# EAGLE design pomodoro-timer-shield (EAGLE 6.3)
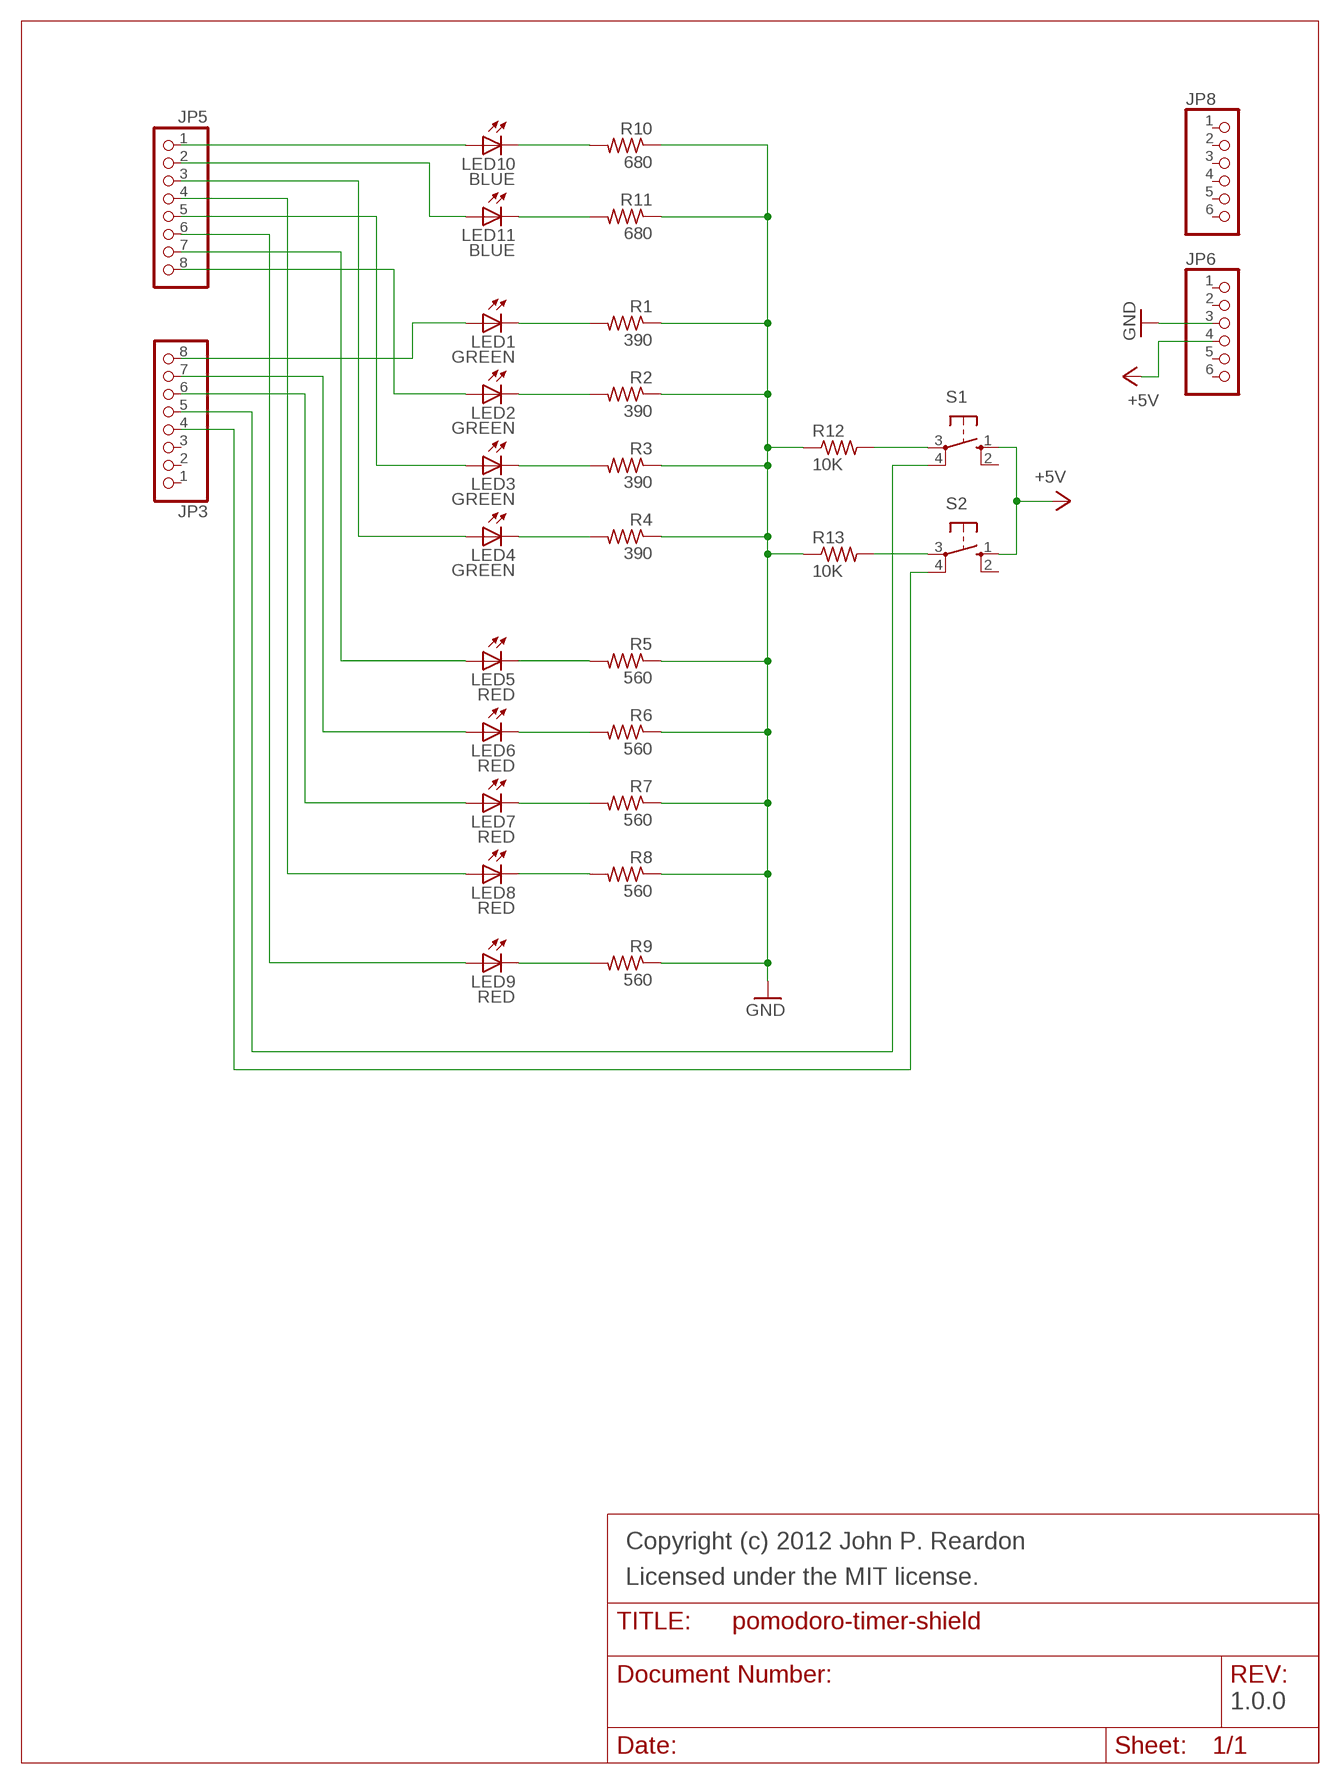
[diagram p0: schematic, sheet 1]

## Parts
JP3  PINHD-1X8CLEANBIG  [1X08-CLEANBIG]
JP5  PINHD-1X8CLEANBIG  [1X08-CLEANBIG]
JP6  PINHD-1X6CB  [1X06-CLEANBIG]
JP8  PINHD-1X6CB  [1X06-CLEANBIG]
LED1  GREEN  LED3MM  [LED3MM]
LED2  GREEN  LED3MM  [LED3MM]
LED3  GREEN  LED3MM  [LED3MM]
LED4  GREEN  LED3MM  [LED3MM]
LED5  RED  LED3MM  [LED3MM]
LED6  RED  LED3MM  [LED3MM]
LED7  RED  LED3MM  [LED3MM]
LED8  RED  LED3MM  [LED3MM]
LED9  RED  LED3MM  [LED3MM]
LED10  BLUE  LED3MM  [LED3MM]
LED11  BLUE  LED3MM  [LED3MM]
R1  390  R-US_0204/7  [0204/7]
R2  390  R-US_0204/7  [0204/7]
R3  390  R-US_0204/7  [0204/7]
R4  390  R-US_0204/7  [0204/7]
R5  560  R-US_0204/7  [0204/7]
R6  560  R-US_0204/7  [0204/7]
R7  560  R-US_0204/7  [0204/7]
R8  560  R-US_0204/7  [0204/7]
R9  560  R-US_0204/7  [0204/7]
R10  680  R-US_0204/7  [0204/7]
R11  680  R-US_0204/7  [0204/7]
R12  10K  R-US_0204/7  [0204/7]
R13  10K  R-US_0204/7  [0204/7]
S1  10-XX  [B3F-10XX]
S2  10-XX  [B3F-10XX]

## Nets
+5V: JP6.4 S1.1(S) S2.1(S)
GND: JP6.3 R1.1 R2.1 R3.1 R4.1 R5.1 R6.1 R7.1 R8.1 R9.1 R10.1 R11.1 R12.1 R13.1
N$1: JP5.1 LED10.A
N$2: LED10.K(C) R10.2
N$3: LED11.K(C) R11.2
N$4: LED5.K(C) R5.2
N$5: LED4.K(C) R4.2
N$6: LED8.K(C) R8.2
N$8: LED3.K(C) R3.2
N$15: LED2.K(C) R2.2
N$16: LED1.K(C) R1.2
N$25: LED7.K(C) R7.2
N$26: LED6.K(C) R6.2
N$27: LED9.K(C) R9.2
N$28: R12.2 S1.3(P)
N$29: R13.2 S2.3(P)
N$35: JP3.5 S1.4(P1)
N$40: JP3.4 S2.4(P1)
N$45: JP5.2 LED11.A
N$54: JP3.8 LED1.A
N$55: JP5.8 LED2.A
N$56: JP5.7 LED5.A
N$57: JP5.5 LED3.A
N$58: JP5.3 LED4.A
N$59: JP3.7 LED6.A
N$62: JP3.6 LED7.A
N$63: JP5.4 LED8.A
N$67: JP5.6 LED9.A
Unconnected: JP3.1 JP3.2 JP3.3 JP6.1 JP6.2 JP6.5 JP6.6 JP8.1 JP8.2 JP8.3 JP8.4 JP8.5 JP8.6 S1.2(S1) S2.2(S1)

## Notes on the sheet
- Copyright (c) 2012 John P. Reardon
- Licensed under the MIT license.
- 1.0.0

## Library data of the parts
JP3 JP5 = carduino:PINHD-1X8: PIN HEADER
JP6 JP8 = carduino:PINHD-1X6: PIN HEADER
LED1-LED11 = led:LED: LED OSRAM: - CHIPLED LG R971, LG N971, LY N971, LG Q971, LY Q971, LO R971, LY R971 LH N974, LH R974 LS Q976, LO Q976, LY Q976 LO Q996 - Hyper CHIPLED LW Q18S LB Q993, LB Q99A, LB R99A - SideLED LS A670, LO A670, LY A670, LG A670, LP A670 LB A673, LV A673, LT A673, LW A673 LH A674 LY A675 LS A676, LA A676, LO A676, LY A676, LW A676 LS A679, LY A679, LG A679 - Hyper Micro SIDELED® LS Y876, LA Y876, LO Y876, LY Y876 LT Y87S - SmartLED LW L88C, LW L88S LB L89C, LB L89S, LG L890 LS L89K, LO L89K, LY L89K LS L896, LA L896, LO L896, LY L896 - TOPLED LS T670, LO T670, LY T670, LG T670, LP T670 LSG T670, LSP T670, LSY T670, LOP T670, LYG T670 LG T671, LOG T671, LSG T671 LB T673, LV T673, LT T673, LW T673 LH T674 LS T676, LA T676, LO T676, LY T676, LB T676, LH T676, LSB T676, LW T676 LB T67C, LV T67C, LT T67C, LS T67K, LO T67K, LY T67K, LW E67C LS E67B, LA E67B, LO E67B, LY E67B, LB E67C, LV E67C, LT E67C LW T67C LS T679, LY T679, LG T679 LS T770, LO T770, LY T770, LG T770, LP T770 LB T773, LV T773, LT T773, LW T773 LH T774 LS E675, LA E675, LY E675, LS T675 LS T776, LA T776, LO T776, LY T776, LB T776 LHGB T686 LT T68C, LB T68C - Hyper Mini TOPLED® LB M676 - Mini TOPLED Santana® LG M470 LS M47K, LO M47K, LY M47K Source: http://www.osram.convergy.de LUXEON: - LUMILED® LXK2-PW12-R00, LXK2-PW12-S00, LXK2-PW14-U00, LXK2-PW14-V00 LXK2-PM12-R00, LXK2-PM12-S00, LXK2-PM14-U00 LXK2-PE12-Q00, LXK2-PE12-R00, LXK2-PE12-S00, LXK2-PE14-T00, LXK2-PE14-U00 LXK2-PB12-K00, LXK2-PB12-L00, LXK2-PB12-M00, LXK2-PB14-N00, LXK2-PB14-P00, LXK2-PB14-Q00 LXK2-PR12-L00, LXK2-PR12-M00, LXK2-PR14-Q00, LXK2-PR14-R00 LXK2-PD12-Q00, LXK2-PD12-R00, LXK2-PD12-S00 LXK2-PH12-R00, LXK2-PH12-S00 LXK2-PL12-P00, LXK2-PL12-Q00, LXK2-PL12-R00 Source: www.luxeon.com KINGBRIGHT: KA-3528ASYC Source: www.kingbright.com
R1-R13 = resistor:R-US_: RESISTOR, American symbol
S1 S2 = switch-omron:10-XX: OMRON SWITCH; MPN: B3F-1000; OC_FARNELL: 176432; OC_NEWARK: 36M3542

## Board
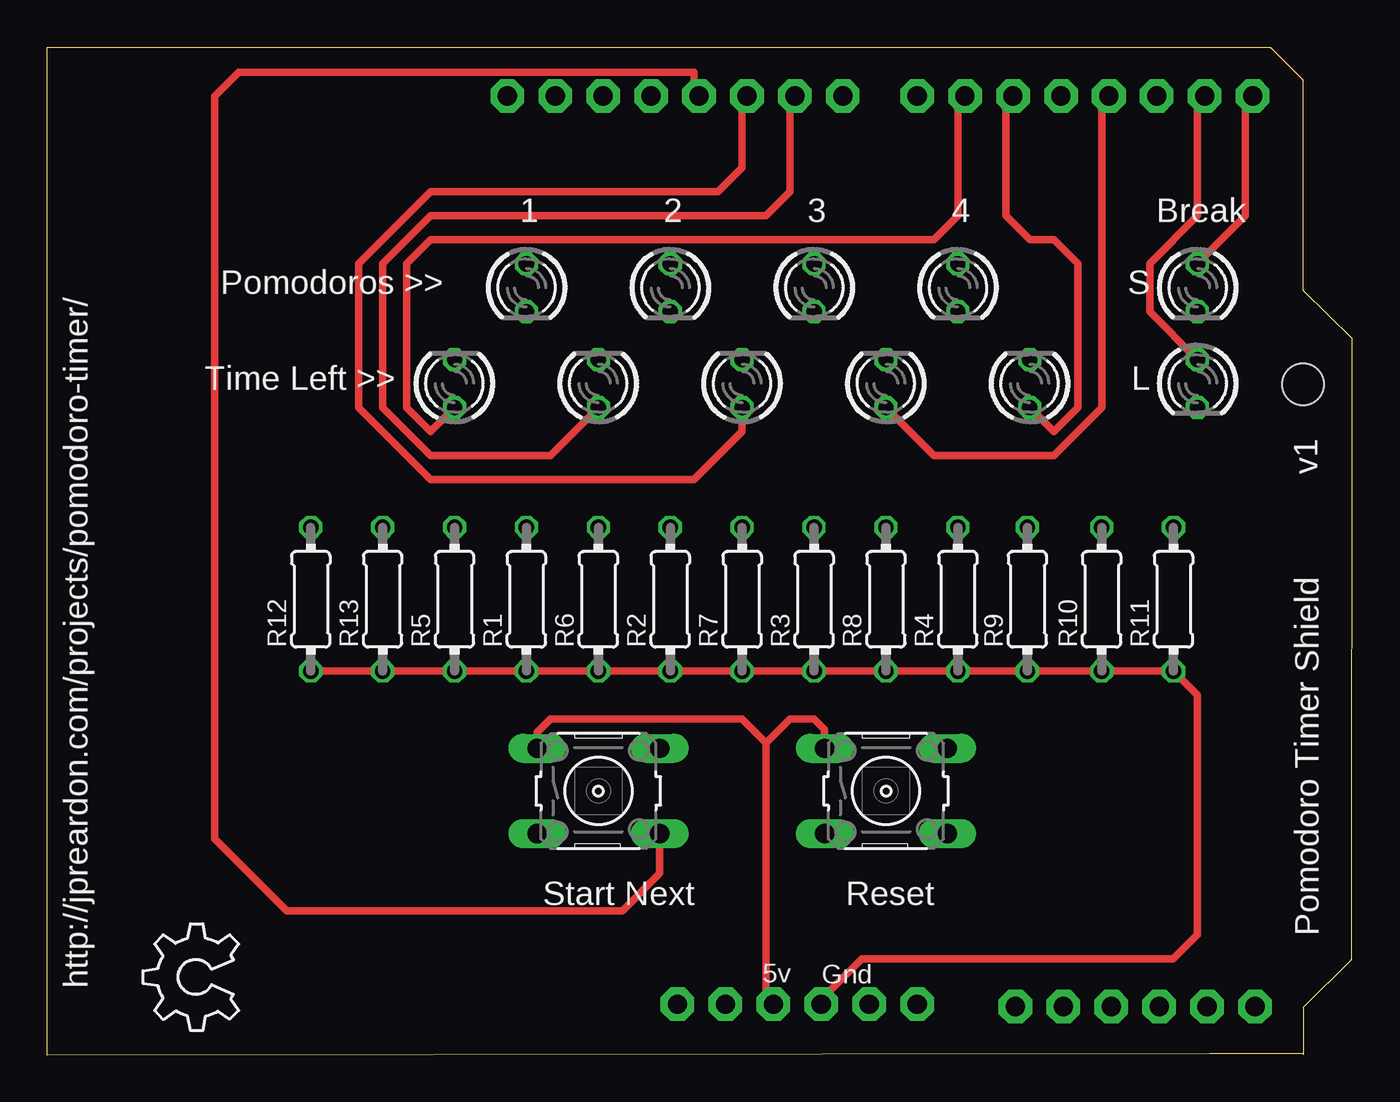
[diagram p1: board, top side]
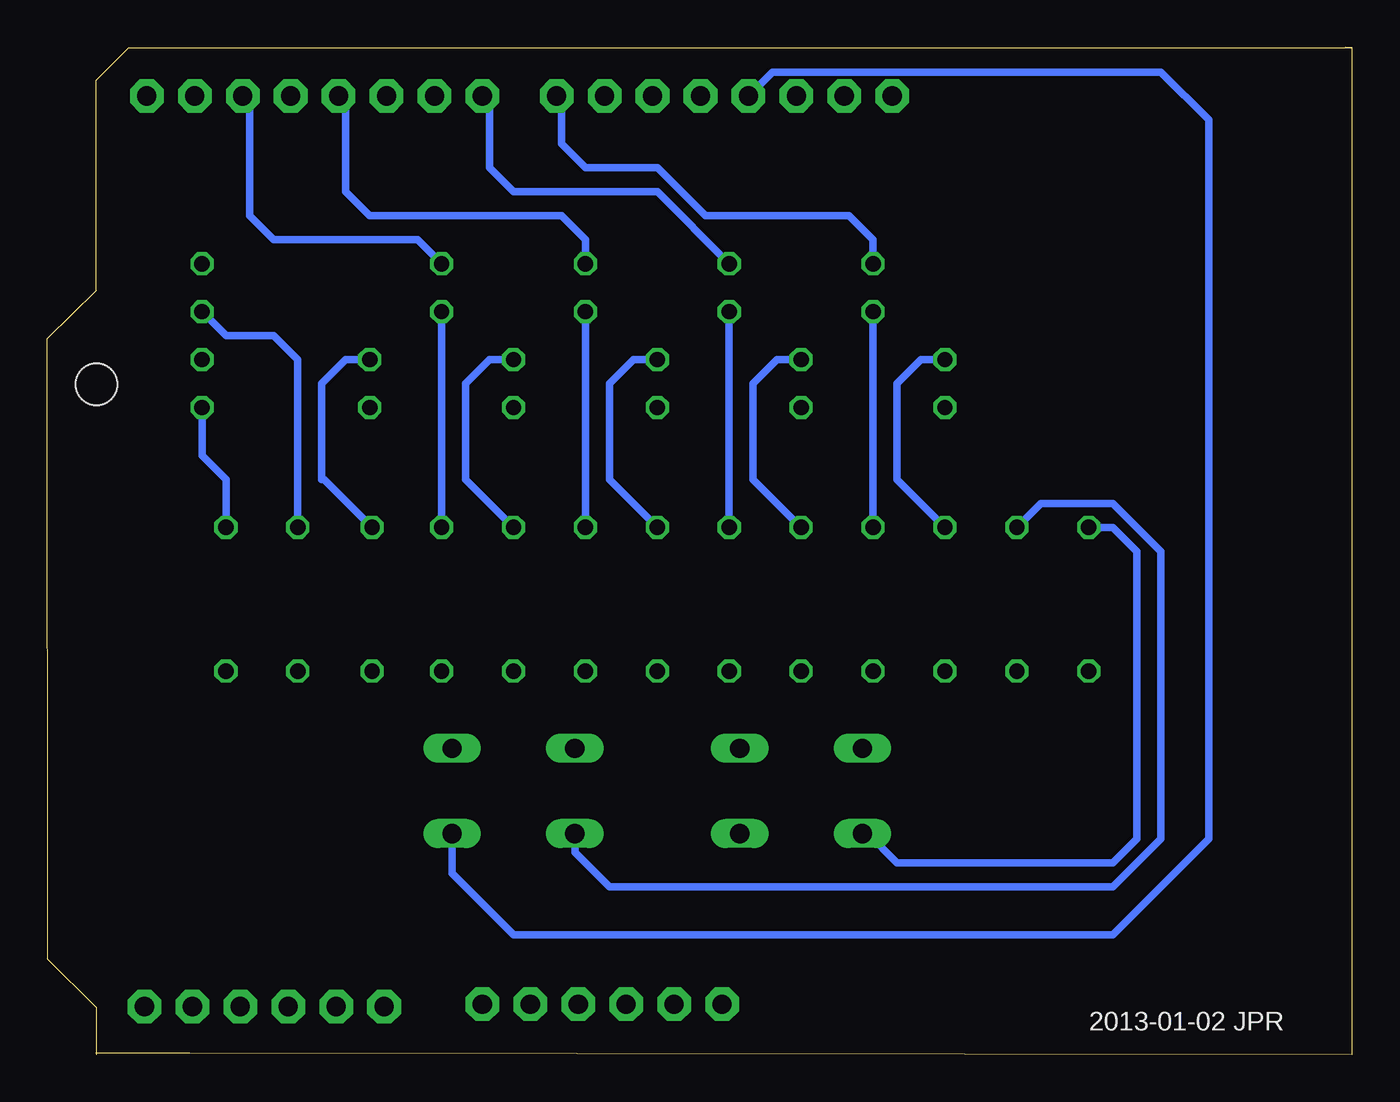
[diagram p2: board, bottom side, seen from below]

Size 69.16 x 53.39 mm. Coordinates in mm from the lower left corner, seen from the top.
Outline: 0,53.35 64.83,53.35 66.55,51.63 66.55,40.49 69.16,37.95 69.13,5.05
Outline: 0,53.35 0.38,53.39
Outline: 69.13,5.05 69.13,5.05
Outline: 69.13,5.05 66.55,2.5 66.57,0
Outline: 0,53.35 0,0 61.6,0.09 66.58,0.08
Copper layers (1*16): Top 0.0356mm / dielectric 1.5011mm / Bottom 0.0356mm
Design rules "LaenPCBOrder": minimum track width 6mil, minimum drill 13mil, track to track 6mil, track to pad 6mil, pad to pad 6mil, via to via 6mil, smd to smd 6mil, copper to edge 15mil, drill to drill 6mil, minimum pad ring 7mil, minimum via ring 7mil, stop-mask expansion 4mil, vias tented up to drill 0mil, thermal gap 10mil
Holes 2.2 mm at 66.55,35.52

### Footprints (pad centres in the part's own frame; a part is rotated, then mirrored left to right if it is on the bottom)
1X08-CLEANBIG = drill 1.016 pad 1.778 octagon: 1 -8.89,0; 2 -6.35,0; 3 -3.81,0; 4 -1.27,0; 5 1.27,0; 6 3.81,0; 7 6.35,0; 8 8.89,0
1X06-CLEANBIG = drill 1.016 pad 1.778 octagon: 1 -6.35,0; 2 -3.81,0; 3 -1.27,0; 4 1.27,0; 5 3.81,0; 6 6.35,0
LED3MM = drill 0.813 octagon: A -1.27,0; K 1.27,0
0204/7 = drill 0.813 octagon: 1 -3.81,0; 2 3.81,0
B3F-10XX = drill 1.016 long: 1 -3.251,2.261; 2 3.251,2.261; 3 -3.251,-2.261; 4 3.251,-2.261

### Placement (x,y rotation side)
JP3  33.27,50.81 0 top
JP5  54.99,50.81 180 top
JP6  39.75,2.67 180 top
JP8  57.65,2.55 0 top
LED1  25.4,40.65 270 top
LED2  33.02,40.65 270 top
LED3  40.64,40.65 270 top
LED4  48.26,40.65 270 top
LED5  21.59,35.57 90 top
LED6  29.21,35.57 90 top
LED7  36.83,35.57 90 top
LED8  44.45,35.57 90 top
LED9  52.07,35.57 90 top
LED10  60.96,40.65 270 top
LED11  60.96,35.57 270 top
R1  25.4,24.14 90 top
R2  33.02,24.14 90 top
R3  40.64,24.14 90 top
R4  48.26,24.14 90 top
R5  21.59,24.14 90 top
R6  29.21,24.14 90 top
R7  36.83,24.14 90 top
R8  44.45,24.14 90 top
R9  51.94,24.14 90 top
R10  55.88,24.14 90 top
R11  59.69,24.14 90 top
R12  13.97,24.14 90 top
R13  17.78,24.14 90 top
S1  29.21,13.98 0 top
S2  44.45,13.98 0 top
U$2  [OSHW_6X200_NOTEXT]  10.16,1.28 90 top

### Tracks (layer width: path | path; a pad name or v marks a point on that pad's centre or on a via)
+5V
  Top 0.406: S1.1 25.96,17.07 26.67,17.79 36.83,17.79 38.1,16.52 | 38.1,16.52 38.1,3.05 JP6.4 | S2.1 41.2,17.23 40.64,17.79 39.37,17.79 38.1,16.52
GND
  Top 0.406: R13.1 R12.1 R5.1 R1.1 R6.1 R2.1 R7.1 R3.1 R8.1 R4.1 R9.1 R10.1 R11.1 60.96,19.06 60.96,6.36 59.69,5.09 43.18,5.09 41.02,2.93 JP6.3
N$1
  Top 0.406: LED10.A 63.5,44.46 63.5,50.42 JP5.1
N$2
  Bottom 0.406: R10.2 55.88,36.84 57.15,38.11 59.69,38.11 LED10.K
N$3
  Bottom 0.406: R11.2 59.69,30.49 60.96,31.76 LED11.K
N$4
  Bottom 0.406: LED5.K 22.86,36.84 24.13,35.57 24.13,30.49 R5.2
N$5
  Bottom 0.406: LED4.K R4.2
N$6
  Bottom 0.406: LED8.K 45.72,36.84 46.99,35.57 46.99,30.49 R8.2
N$8
  Bottom 0.406: LED3.K R3.2
N$15
  Bottom 0.406: LED2.K R2.2
N$16
  Bottom 0.406: LED1.K R1.2
N$25
  Bottom 0.406: LED7.K 38.1,36.84 39.37,35.57 39.37,30.49 R7.2
N$26
  Bottom 0.406: LED6.K 30.48,36.84 31.75,35.57 31.75,30.49 R6.2
N$27
  Bottom 0.406: LED9.K 53.34,36.84 54.61,35.57 54.61,30.49 54.48,30.49 R9.2
N$28
  Bottom 0.406: S1.3 25.68,11.71 24.13,10.17 12.7,10.17 11.43,11.44 11.43,26.68 12.7,27.95 R12.2
N$29
  Bottom 0.406: S2.3 41.2,10.72 39.37,8.9 12.7,8.9 10.16,11.44 10.16,26.68 12.7,29.22 16.51,29.22 R13.2
N$35
  Top 0.406: S1.4 32.46,9.61 30.48,7.63 12.7,7.63 8.89,11.44 8.89,50.81 10.16,52.08 34.29,52.08 34.29,51.06 JP3.5
N$40
  Bottom 0.406: S2.4 47.7,9.61 44.45,6.36 12.7,6.36 7.62,11.44 7.62,49.54 10.16,52.08 30.73,52.08 JP3.4
N$45
  Top 0.406: LED11.A 58.42,39.38 58.42,41.92 60.96,44.46 60.96,50.42 JP5.2
N$54
  Bottom 0.406: LED1.A 25.4,43.19 26.67,44.46 34.29,44.46 36.83,47 40.64,47 41.91,48.27 41.91,50.55 JP3.8
N$55
  Bottom 0.406: LED2.A 36.83,45.73 44.45,45.73 45.72,47 45.72,50.42 JP5.8
N$56
  Top 0.406: LED5.A 20.32,33.03 19.05,34.3 19.05,41.92 20.32,43.19 46.99,43.19 48.26,44.46 48.26,50.42 JP5.7
N$57
  Bottom 0.406: LED3.A 40.64,43.19 41.91,44.46 52.07,44.46 53.34,45.73 53.34,50.42 JP5.5
N$58
  Bottom 0.406: LED4.A 49.53,43.19 57.15,43.19 58.42,44.46 58.42,50.42 JP5.3
N$59
  Top 0.406: LED6.A 26.67,31.76 20.32,31.76 17.78,34.3 17.78,41.92 20.32,44.46 38.1,44.46 39.37,45.73 39.37,50.55 JP3.7
N$62
  Top 0.406: LED7.A 36.83,33.03 34.29,30.49 20.32,30.49 16.51,34.3 16.51,41.92 20.32,45.73 35.56,45.73 36.83,47 36.83,50.55 JP3.6
N$63
  Top 0.406: LED8.A 46.99,31.76 53.34,31.76 55.88,34.3 55.88,50.42 JP5.4
N$67
  Top 0.406: LED9.A 53.34,33.03 54.61,34.3 54.61,41.92 53.34,43.19 52.07,43.19 50.8,44.46 50.8,50.42 JP5.6

### Text on the board
tPlace: 1 | 2 | 3 | 4 | Break | Pomodoros >> | S | Time Left >> | L | v1 | Start Next | Reset | Pomodoro Timer Shield | 5v | http://jpreardon.com/projects/pomodoro-timer/ | Gnd
bPlace: 2013-01-02 JPR